# Altium schematic sheet LevelShifterSchem.SchDoc
size A; DrawnBy: *Carlos Sanchez; SheetNumber: 1; SheetTotal: 5
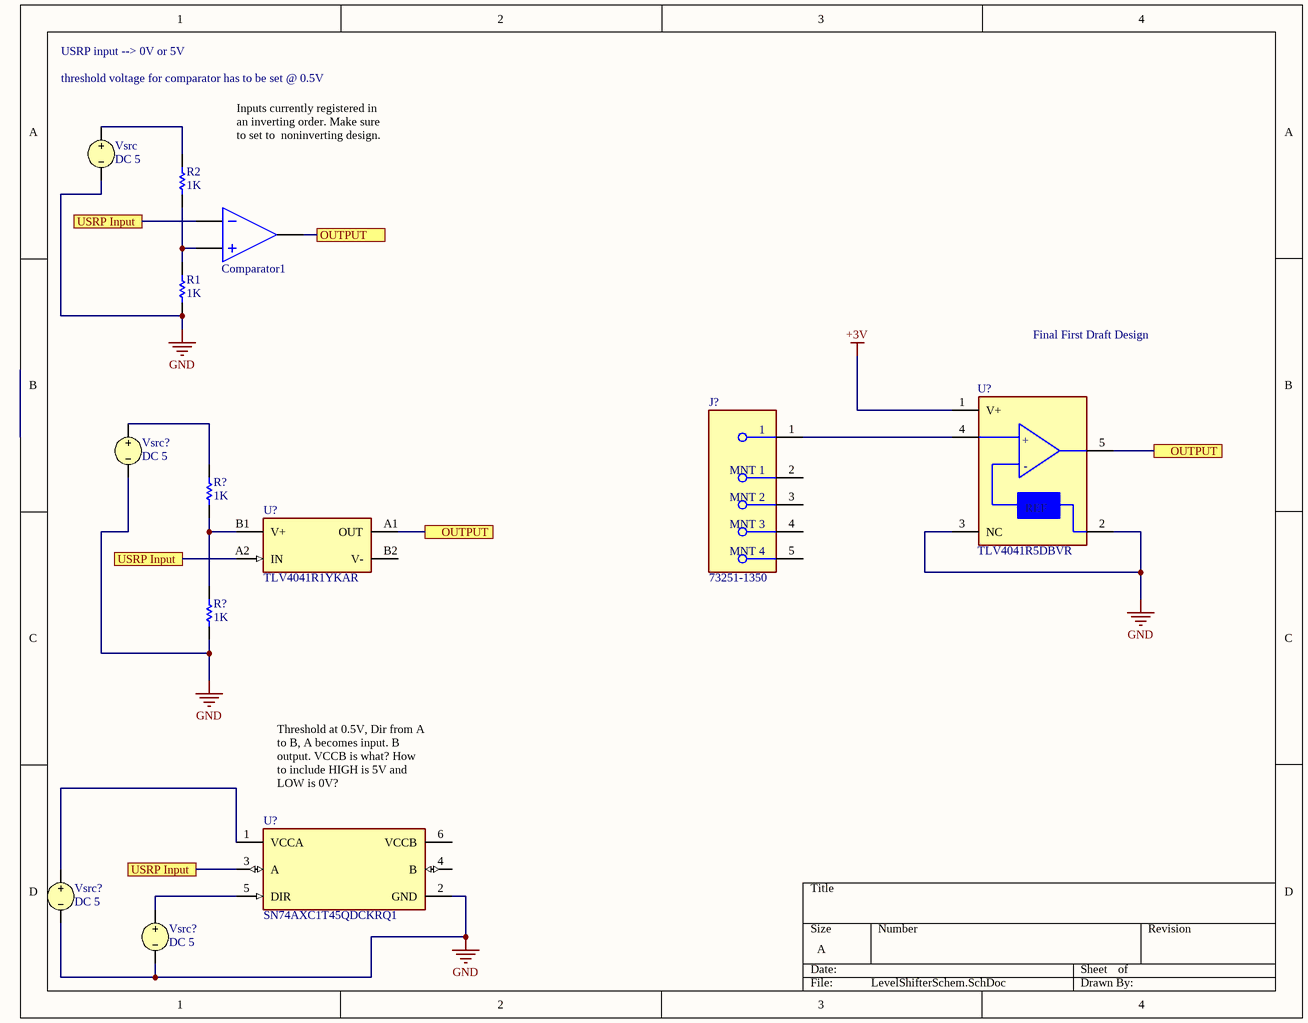
[diagram p0: LevelShifterSchem.SchDoc]

## Parts
(Parts that share a designator on the sheet are numbered #1, #2 ... from top to bottom, then left to right.)
Comparator1  Ideal Comparator  (value not drawn)
J?  73251-1350  [FP-73251-1350-MFG]
R1  value 1K  (hidden comment: Resistor)
R2  value 1K  (hidden comment: Resistor)
R?#1  value 1K  (hidden comment: Resistor)
R?#2  value 1K  (hidden comment: Resistor)
U?#1  TLV4041R5DBVR  [FP-DBV0005A-IPC_C]
U?#2  TLV4041R1YKAR  [FP-YKA0004-MFG]
U?#3  SN74AXC1T45QDCKRQ1  [FP-DCK0006A-MFG]
Vsrc  DC 5
Vsrc?#1  DC 5
Vsrc?#2  DC 5
Vsrc?#3  DC 5

## Ports
OUTPUT, USRP Input

## Nets
+3V: U?#1.1(V+)
GND: R1.1 R?#2.1 U?#1.2(V-) U?#1.3(NC) U?#3.2(GND) Vsrc.2 Vsrc?#1.2 Vsrc?#2.2 Vsrc?#3.2
OUTPUT: Comparator1.3(OUT) U?#1.5(OUT) U?#2.A1(OUT) ; port OUTPUT
USRP Input: Comparator1.1(IN-) U?#2.A2(IN) U?#3.3(A) ; port USRP Input
NetComparator1_2: Comparator1.2(IN+) R1.2 R2.1
NetJ?_1: J?.1 U?#1.4(IN)
NetR2_2: R2.2 Vsrc.1
NetR?#1_1: R?#1.1 R?#2.2 U?#2.B1(V+)
NetR?#1_2: R?#1.2 Vsrc?#1.1
NetU?#3_1: U?#3.1(VCCA) Vsrc?#2.1
NetU?#3_5: U?#3.5(DIR) Vsrc?#3.1

Not connected (* = marked no-connect by the designer): J? 2(MNT_1) 3(MNT_2) 4(MNT_3) 5(MNT_4); U?#2 B2(V-); U?#3 4(B) 6(VCCB)

## Notes on the sheet
- USRP input --> 0V or 5V
- threshold voltage for comparator has to be set @ 0.5V
- Inputs currently registered in an inverting order. Make sure to set to  noninverting design.
- Final First Draft Design
- (near U?#3) Threshold at 0.5V, Dir from A to B, A becomes input. B output. VCCB is what? How to include HIGH is 5V and LOW is 0V?
- (in symbol CMP-04896-000141-1) +; -; REF

## Library data of the parts
Comparator1 = Comparator: VHIGH: 5; VLOW: 0; VHYS: 50m; SimulationGenericComponent: True
J? = CMP-04764-000006-1: CONN SMA JACK STR 50 OHM SMD; Manufacturer: Molex; Is Female: yes; Standoff Height: 0.41mm; Impedance: 50Ω; Number Of Contacts: 1; Conn Orientation: Straight; Voltage Rating: 500V; Shielding: true; Frequency: 18GHz; Package: 73251-1350; Device Class L1: Connectors; Category: Conn; Manufacturer Part Number: 73251-1350; ComponentLink2URL: https://www.molex.com/pdm_docs/sd/732511350_sd.pdf; Automotive: No; Height: 9.655mm; Octopart: https://octopart.com/73251-1350-molex-5414390; Footprint Url: https://forum.upverter.com/uploads/default/original/3X/d/a/daeafa2ce4908d4fc4e49f0b17d7d2c986fce444.pdf; Temperature Range High: +165°C; Device Class L3: unset; Mouser Description: RF Connectors / Coaxial Connectors SMA ST PCB-JCK STD SMT; Lead Free: Yes; Temperature: -65°C to +165°C; RoHS: TRUE; ComponentLink2Description: Datasheet; Device Class L2: RF / Coaxial Connectors; Digikey Description: CONN SMA JACK STR 50 OHM SMD; Contact Material: Gold; Temperature Range Low: -65°C
R1 R2 R?#1 R?#2 = Resistor: TC1: 0; SimulationGenericComponent: True; TC2: 0
U?#1 = CMP-04896-000141-1: LOW-POWER COMPARATOR WITH REFERE
U?#2 = CMP-04896-000145-1: IC COMPARATOR
U?#3 = CMP-04899-000038-1: IC LOGIC BUFFER/DRIVER
Vsrc Vsrc?#1-Vsrc?#3 = VSRC: Voltage Source; Note: PCB Footprint - Not required; AC Magnitude: 1; AC Phase: 0; Value: 5; Published: 8-Jun-2000; LatestRevisionDate: 17-Jul-2002; LatestRevisionNote: Re-released for DXP Platform.; PackageReference: Not Applicable; Publisher: Altium Limited